# Altium project PCB_Project.PrjPcb
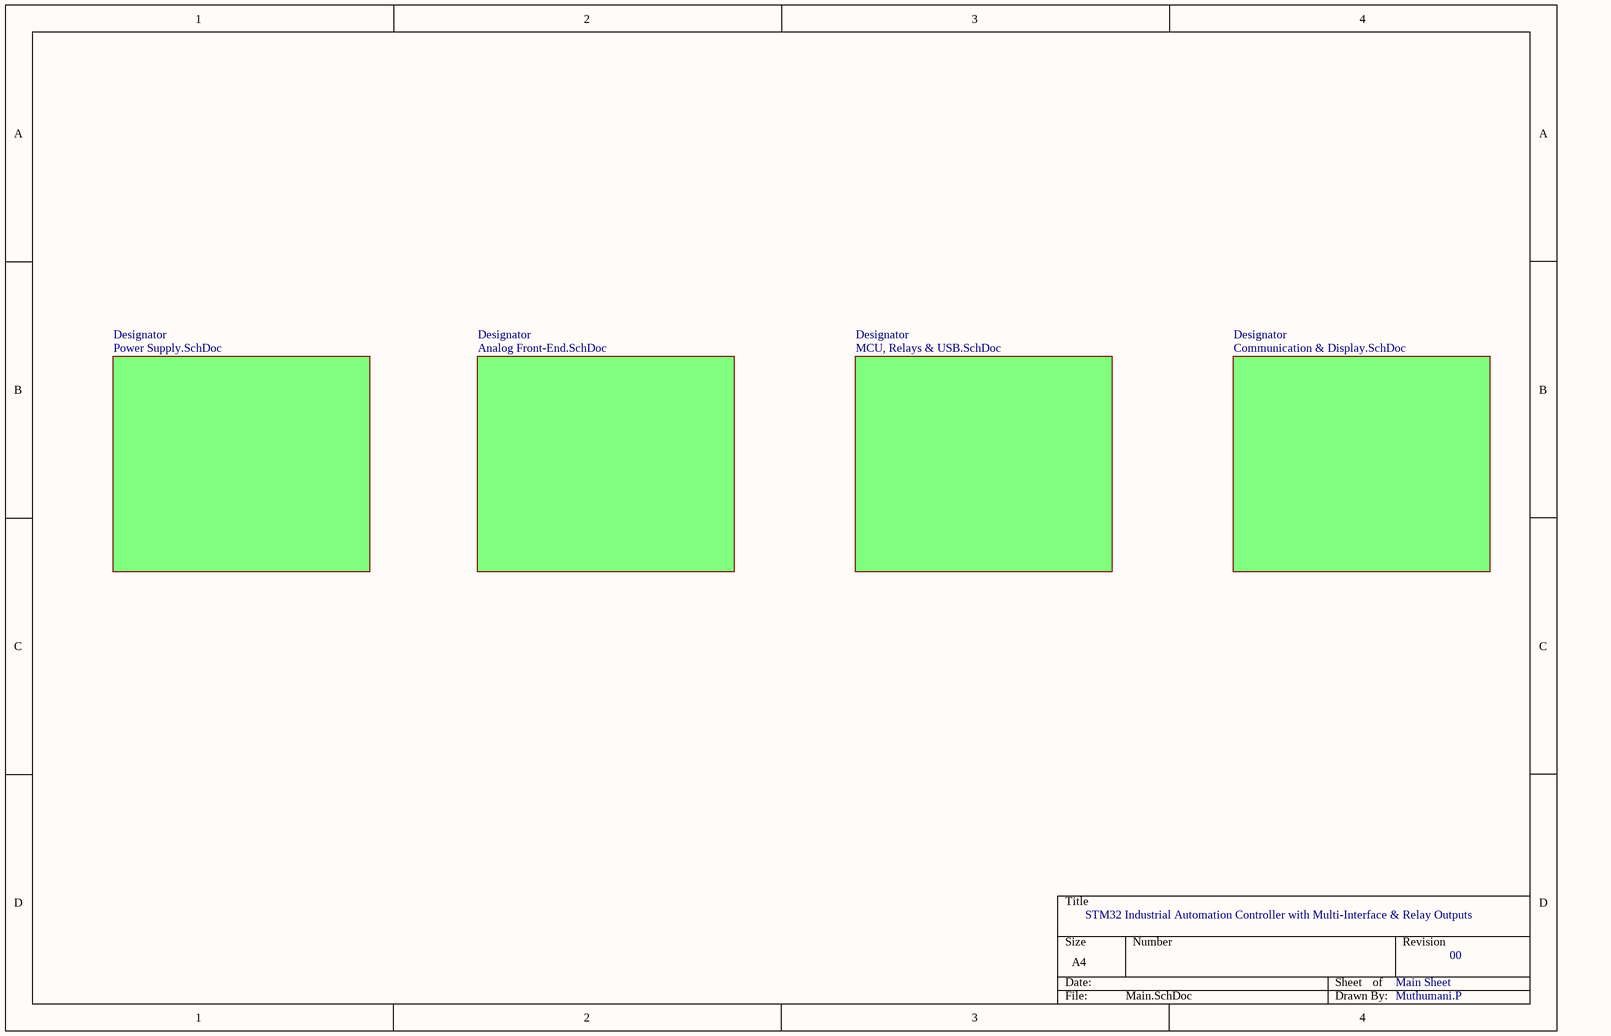
[diagram p0: Main.SchDoc]
5 sheets, 82 parts. Net scope: flat (ports and power ports of the same name join across sheets).
Board file: PCB1.PcbDoc
Sheets:
  Main.SchDoc
    Designator = Power Supply.SchDoc
    Designator = Analog Front-End.SchDoc
    Designator = MCU, Relays & USB.SchDoc
    Designator = Communication & Display.SchDoc

## Sheet Main.SchDoc
size A4; SheetNumber: 1; SheetTotal: 4

### Sub-sheets
Designator = Power Supply.SchDoc: no entries
Designator = Analog Front-End.SchDoc: no entries
Designator = MCU, Relays & USB.SchDoc: no entries
Designator = Communication & Display.SchDoc: no entries

### Notes on the sheet
- STM32 Industrial Automation Controller with Multi-Interface & Relay Outputs
- Main Sheet
- 00
- Muthumani.P

## Sheet Power Supply.SchDoc
size A4; SheetNumber: 2; SheetTotal: 4
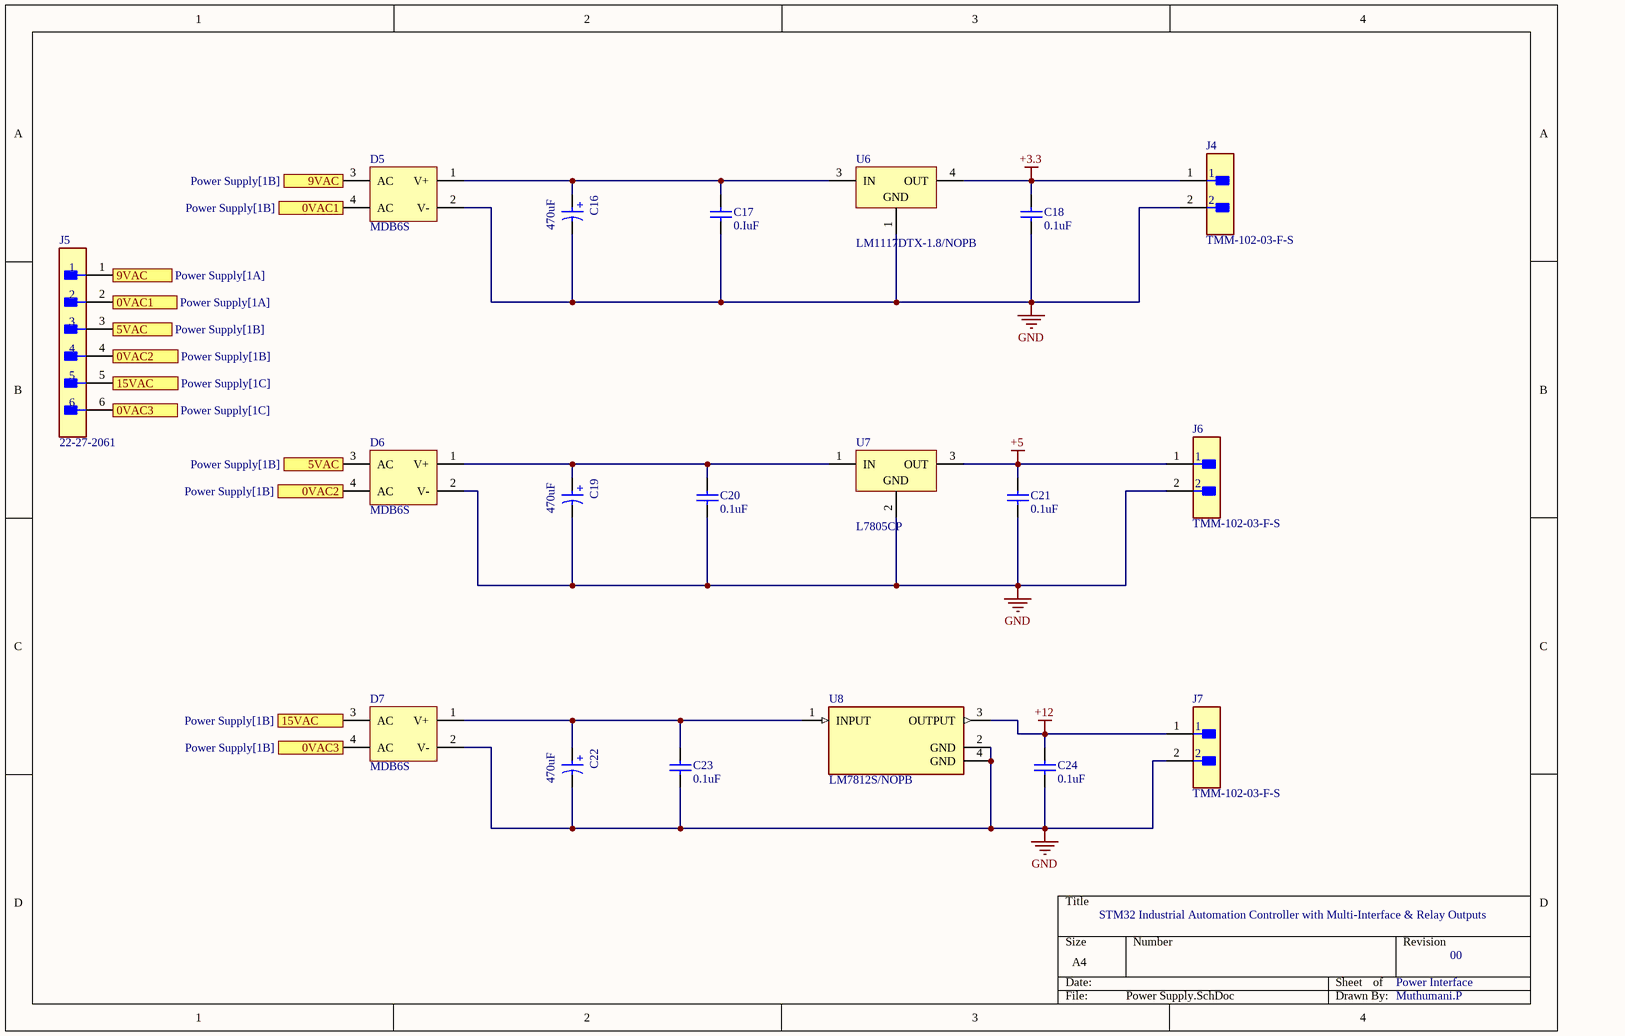
[diagram p1: Power Supply.SchDoc]

### Parts
C16  470uF  [WCAP-ATLI_D13H25]
C17  0.IuF  [CAPC2013X145X50NL20T25]
C18  0.1uF  [CAPC2013X145X50NL20T25]
C19  470uF  [WCAP-ATLI_D13H25]
C20  0.1uF  [CAPC2013X145X50NL20T25]
C21  0.1uF  [CAPC2013X145X50NL20T25]
C22  470uF  [WCAP-ATLI_D13H25]
C23  0.1uF  [CAPC2013X145X50NL20T25]
C24  0.1uF  [CAPC2013X145X50NL20T25]
D5  MDB6S  [FAIR-MDBXS-4_V]
D6  MDB6S  [FAIR-MDBXS-4_V]
D7  MDB6S  [FAIR-MDBXS-4_V]
J4  TMM-102-03-F-S  [FP-TMM-102-03-F-S-MFG]
J5  22-27-2061  [FP-22-27-2061-MFG]
J6  TMM-102-03-F-S  [FP-TMM-102-03-F-S-MFG]
J7  TMM-102-03-F-S  [FP-TMM-102-03-F-S-MFG]
U6  LM1117DTX-1.8/NOPB  [NDP0003B_N]
U7  L7805CP  [TO220FP]
U8  LM7812S/NOPB  [FP-KTT0003B-MFG]

### Ports
0VAC1 (in, see Power Supply[1B]), 0VAC1 (out, see Power Supply[1A]), 0VAC2 (in, see Power Supply[1B]), 0VAC2 (out, see Power Supply[1B]), 0VAC3 (in, see Power Supply[1B]), 0VAC3 (out, see Power Supply[1C]), 5VAC (in, see Power Supply[1B]), 5VAC (out, see Power Supply[1B]), 9VAC (in, see Power Supply[1B]), 9VAC (out, see Power Supply[1A]), 15VAC (in, see Power Supply[1B]), 15VAC (out, see Power Supply[1C])

### Nets
+3.3: C18.2 J4.1 U6.4(OUT)
+5: C21.2 J6.1 U7.3(OUT)
+12: C24.2 J7.1 U8.3(OUTPUT)
GND: C16.2(N) C17.1 C18.1 C19.2(N) C20.1 C21.1 C22.2(N) C23.1 C24.1 D5.2(V-) D6.2(V-) D7.2(V-) J4.2 J6.2 J7.2 U6.1(GND) U7.2(GND) U8.2(GND) U8.4(GND)
NetC16_1: C16.1(P) C17.2 D5.1(V+) U6.3(IN)
NetC19_1: C19.1(P) C20.2 D6.1(V+) U7.1(IN)
NetC22_1: C22.1(P) C23.2 D7.1(V+) U8.1(INPUT)
NetD5_3: D5.3(AC) J5.1 ; port 9VAC
NetD5_4: D5.4(AC) J5.2 ; port 0VAC1
NetD6_3: D6.3(AC) J5.3 ; port 5VAC
NetD6_4: D6.4(AC) J5.4 ; port 0VAC2
NetD7_3: D7.3(AC) J5.5 ; port 15VAC
NetD7_4: D7.4(AC) J5.6 ; port 0VAC3

### Notes on the sheet
- STM32 Industrial Automation Controller with Multi-Interface & Relay Outputs
- Power Interface
- 00
- Muthumani.P
- (in symbol CMP-03913-54218056-2) +

### Library data of the parts
C16 C19 C22 = CMP-03913-54218056-2: Cap, 2700Uf, 16V, Alu Elec, Radial Rohs Compliant: Yes; Life (Hours): 5000hours; Pitch: 5mm; Capacitance: 2.7mF; Leakage Current: 432µA; Tolerance: 20%; Polarity: Polar; Impedance: 22mΩ; Ripple Current: 3A; Mount: Through Hole; Voltage Rating: 16V; Max Operating Temperature: 105°C; Min Operating Temperature: -55°C; Case/Package: Radial; Length: 25mm; Diameter: 13mm; Height - Seated (Max): 26.4922mm; Packaging: Tape & Box (TB); Lead Pitch: 5.0038mm; RoHS: Compliant
C17 C18 C20 C21 C23 C24 = CMP-2007-01227-1: Manufacturer: Kemet; Part Number: C0805S104K5RACTU
D5-D7 = CMP-0950-00003-1: 600 V, 1 A, Single-Phase Bridge Rectifier, -55 to 150 degC, 4-Pin 5 x 4.4 x 1.6 mm MicroDIP, RoHS, Tape and Reel; Manufacturer: Fairchild Semiconductor; IR: 10 uA; VF: 1.1 V; IF (AV): 1 A; VRRM: 600 V; CJ: 10 pF; IFSM: 30 A; ComponentLink1URL: http://www.fairchildsemi.com/; PackageDescription: 4-Pin Micro Surface Mount, Body 5 x 4.4 mm, Height 1.6 mm; ComponentLink1Description: Manufacturer URL; DatasheetVersion: Rev. 1.2.1; PackageReference: MDBXS-4; ComponentLink2Description: Datasheet; ComponentLink2URL: http://www.fairchildsemi.com/ds/MD/MDB10S.pdf; Temp. Range: -55 to 150 degC; Mounting Technology: Surface Mount; PartNumber: MDB6S; Packing: Tape and Reel; RoHS: TRUE
J4 J6 J7 = CMP-02766-001614-1: CONN HEADER VERT 2POS 2MM; Number of Contacts: 2; Gender: Male; Pitch: 2mm; Packaging: Bulk; RoHS Compliant: Yes; Termination: Solder; Contact Plating: Gold; Mount: Through Hole; Number of Rows: 1; Radiation Hardening: No; Lead Free: Lead Free
J5 = CMP-04776-000309-1: CONN HEADER VERT 6POS 2.54MM; Number of Contacts: 6; Current Rating: 4A; Voltage Rating (AC): 250V; Contact Resistance: 10mR; Hole Diameter: 1.02mm; Connector Type: Male Pin; Gender: Male; Mount: Through Hole; REACH SVHC: No SVHC; Number of Rows: 1; Contact Plating: Tin; Series: KK; Depth: 5.8mm; Flammability Rating: UL94 V-0; Contact Type: Male Pin; Lead Pitch: 2.54mm; Min Operating Temperature: 0°C; Pitch: 2.54mm; Radiation Hardening: No; Color: Natural; Length: 15.24mm; Termination: Solder; Orientation: Straight; Contact Material: Brass; Max Voltage Rating (AC): 250V; Housing Material: Nylon; Max Operating Temperature: 75°C; Working Voltage: 250V; Max Current Rating: 4A; Fastening Type: Friction; Voltage Rating: 250V; Housing Color: White; Packaging: Bulk; Material: Nylon; Contact Mating Length: 0.295inch; Package Quantity: 10000; Number of Positions: 6
U6 = CMP-0062-00684-3: 800mA Low-Dropout Linear Regulator, 3-pin TO-252, Pb-Free; Manufacturer: Texas Instruments; PowerWise: N; CompType: LDO IC; PackageTopMarking: NSUZXYTT*LM1117*DT-1.8; ComponentLink1URL: http://www.ti.com/general/docs/lit/getliterature.tsp?genericPartNumber=LM1117-N&fileType=pdf; PackageDescription: TO252, Molded, Jedec, 6.8 x 6.10 x 2.30mm Body, 3 Lead, 2.28mm Pitch, Surface Mount; PinCount: 3; PackageReference: NDP0003B; ComponentLink1Description: Datasheet URL; Code_JEDEC: TO-252-AA; RoHS: Y
U7 = CMP-0244-00474-1: Positive Voltage Regulator, 5V, 3-Pin TO-220FP; ComponentLink1Description: Manufacturer URL; ComponentLink2Description: Datasheet; DatasheetVersion: 16/11/2011; PackageDescription: TO, Thru-Hole, Vertical, Heatsink Mounted; 3 In-Line Leads; Pitch 2.54 mm; ComponentLink2URL: http://www.st.com/internet/com/TECHNICAL_RESOURCES/TECHNICAL_LITERATURE/DATASHEET/CD00000444.pdf; ComponentLink1URL: http://www.st.com; PackageVersion: 2011; PackageReference: TO220FP
U8 = CMP-04917-000197-1: IC REG LINEAR 12V 1.5A; Quiescent Current: 8mA; Dropout Voltage: 2V; Lead Free: Contains Lead; RoHS Compliant: Yes; Min Operating Temperature: 0°C; Case/Package: TO-263; Max Operating Temperature: 125°C

## Sheet Analog Front-End.SchDoc
size A4; SheetNumber: 3; SheetTotal: 5
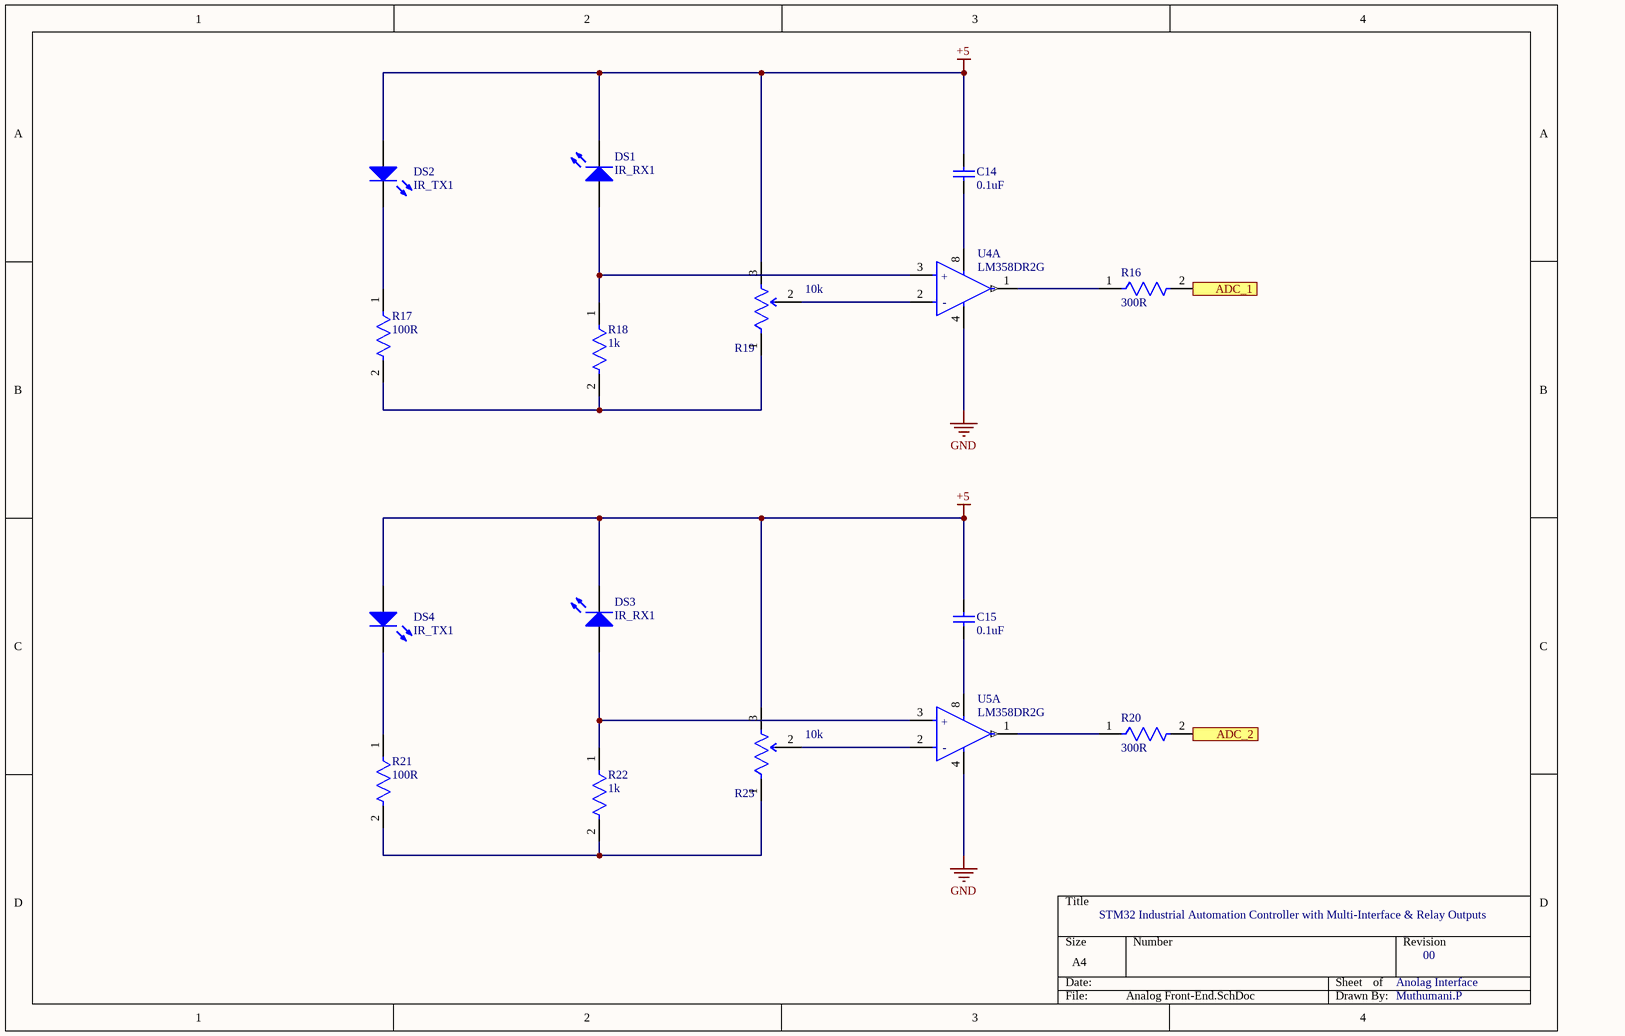
[diagram p2: Analog Front-End.SchDoc]

### Parts
C14  0.1uF  [CAPC2013X145X50NL20T25]
C15  0.1uF  [CAPC2013X145X50NL20T25]
DS1  IR_RX1  [VISH-TSAL6200]
DS2  IR_TX1  [VISH-TSAL6200]
DS3  IR_RX1  [VISH-TSAL6200]
DS4  IR_TX1  [VISH-TSAL6200]
R16  300R  [FP-AC1206-MFG]
R17  100R  [FP-AC1206-MFG]
R18  1k  [FP-AC1206-MFG]
R19  10k  [FP-3296W-MFG]
R20  300R  [FP-AC1206-MFG]
R21  100R  [FP-AC1206-MFG]
R22  1k  [FP-AC1206-MFG]
R23  10k  [FP-3296W-MFG]
U4  LM358DR2G  [FP-751-07-IPC_C]  (part A of 2)
U5  LM358DR2G  [FP-751-07-IPC_C]  (part A of 2)

### Ports
ADC_1 (out, see MCU, Relays & USB[3B]), ADC_2 (out, see MCU, Relays & USB[3C])

### Nets
+5: C14.1 C15.1 DS1.2(K) DS2.1(A) DS3.2(K) DS4.1(A) R19.3(CW) R23.3(CW)
GND: U4.4(VEE/GND) U5.4(VEE/GND)
NetC14_2: C14.2 U4.8(VCC)
NetC15_2: C15.2 U5.8(VCC)
NetDS1_1: DS1.1(A) R18.1 U4.3(INPUT_A+)
NetDS2_2: DS2.2(K) R17.1
NetDS3_1: DS3.1(A) R22.1 U5.3(INPUT_A+)
NetDS4_2: DS4.2(K) R21.1
NetR16_1: R16.1 U4.1(OUTPUT_A)
NetR16_2: R16.2 ; port ADC_1
NetR17_2: R17.2 R18.2 R19.1(CCW)
NetR19_2: R19.2(WIPER) U4.2(INPUT_A-)
NetR20_1: R20.1 U5.1(OUTPUT_A)
NetR20_2: R20.2 ; port ADC_2
NetR21_2: R21.2 R22.2 R23.1(CCW)
NetR23_2: R23.2(WIPER) U5.2(INPUT_A-)

### Notes on the sheet
- STM32 Industrial Automation Controller with Multi-Interface & Relay Outputs
- Anolag Interface
- 00
- Muthumani.P
- (in symbol CMP-1310-00291-2, part A) +; -

### Library data of the parts
C14 C15 = CMP-2007-01227-1: as C17 on sheet Power Supply
DS1-DS4 = CMP-2000-07327-1: High Power Infrared Emitting Diode, GaAlAs, MQW, 1.35 V, 100 mA, -40 to 85 degC, 2-Pin THD, RoHS, Bulk; Manufacturer: Vishay; Lum Intensity: 500mW/srmcd; Product Depth (mm): 5.8mm; Type: IrLED; Luminous Intensity: 500mW/sr; Forward Voltage: 3V; Shape Type: Circular; Peak Wavelength: 950nm; Rad Hardened: No; Product Height (mm): 8.7mm; Number of  Elements: 1; Forward Current: 100mA; High Brightness: Yes; Reverse Voltage: 5V; DELETED: Compliant; Power Dissipation: 160W; Viewing Angle: 34deg; Lens Type: Colored; Packaging: Bulk; Lens Dimensions: 5x5x7.7mm; Package Reference: TSAL6200; Chip Material: GaAlAs; Package Description: 2-Pin Through Hole Device, Dia 5.8 mm, Pitch 2.54 mm; Main Category: IrLED; Manufacturer URL: http://www.vishay.com/; Product Length (mm): 5.8mm; Datasheet URL: http://www.vishay.com/docs/81010/tsal6200.pdf; Operating Temperature Classification: Industrial; Package Type: T-13/4; Pin Count: 2; Mounting: ThroughHole; Mounting Technology: ThroughHole; Test Current (It): 100mA; Datasheet Version: Rev. 2.4, 03/2014; Operating Temp Range: -40Cto85C
R16-R18 R20-R22 = CMP-03412-006130-1: RES SMD 6.2K OHM 5% 1/4W 1206; Manufacturer: Yageo; Manufacturer Part Number: AC1206JR-076K2L; Resistance: 6.2KΩ; Tolerance: 0.05; Voltage Rating: 200V; Automotive Grade: Grade 0; Value: 6.2KΩ; Power Rating: 0.25W; Temperature: -55°C to +155°C; Octopart: https://octopart.com/ac1206jr-076k2l-yageo-30511322; Footprint Url: http://www.yageo.com/exep/pages/download/literatures/PYu-R_Mount_10.pdf; Composition: Thick Film; Device Class L2: Resistors; Temperature Range High: +155°C; Series: AC; Mouser Description: Thick Film Resistors - SMD 1/4W 6.2K ohm 5% AEC-Q200; Device Class L1: Passive Components; Temperature Range Low: -55°C; Height: 0.65mm; Ipc Land Pattern Name: RESC310160X55; Device Class L3: Chip SMD Resistors; ComponentLink2Description: Datasheet; Category: Res; RoHS: TRUE; Automotive: Yes; ComponentLink2URL: http://www.yageo.com/NewPortal/yageodocoutput?fileName=/pdf/R-Chip/PYu-AC_51_RoHS_L_6.pdf; Lead Free: Yes; Package: AC1206; Digikey Description: RES SMD 6.2K OHM 5% 1/4W 1206
R19 R23 = CMP-1747-00001-8: TRIMMER 10K OHM 0.5W PC PIN TOP; Number of Turns: 25; Tolerance: 10%; Resistance: 10kR; Max Power Dissipation: 500mW; Temperature Coefficient: 100ppm/°C; Insulation Resistance: 1GR; Min Operating Temperature: -55°C; Resistor Type: Cermet; Series: 3296; Color: Blue; Mount: Through Hole; Taper: Linear; Radiation Hardening: No; RoHS Compliant: Yes; Width: 9.53mm; Resistance Tolerance: 10%; Contact Plating: Tin; Military Standard: Not; Package Quantity: 50; Weight: 0.03oz; Lead Free: Lead Free; Power Rating: 500mW; Termination: Pin; Technology: CERMET; Max Operating Temperature: 125°C; Packaging: Rail/Tube; Length: 9.53mm; Depth: 4.83mm; Height: 11.55mm; Reach SVHC Compliant: Yes
U4 U5 = CMP-1310-00291-2: IC OPAMP GP 2 CIRCUIT 8SOIC; Gain Bandwidth Product: 1MHz; Number of Circuits: 2; Min Supply Voltage: 3V; Slew Rate: 0.6V/µs; Max Dual Supply Voltage: 16V; Common Mode Rejection Ratio: 65dB; Input Bias Current: 250nA; Min Dual Supply Voltage: 1.5V; Dual Supply Voltage: 9V; Operating Supply Current: 1.5mA; Output Current: 40mA; Input Offset Voltage (Vos): 7mV; Nominal Supply Current: 1.2mA; Voltage Gain: 100dB; Max Supply Voltage: 32V; Width: 4mm; Number of Pins: 8; Min Operating Temperature: 0°C; REACH SVHC: No SVHC; Contact Plating: Tin; Lead Free: Lead Free; Halogen Free: Halogen Free; Power Supply Rejection Ratio (PSRR): 65dB; Operating Supply Voltage: 16V; Package Quantity: 2500; Max Operating Temperature: 70°C; Case/Package: SOIC; Height: 1.5mm; Packaging: Tape and Reel; Radiation Hardening: No; Number of Channels: 2; Bandwidth: 1MHz; Length: 5mm; Number of Elements: 2; Number of Amplifiers: 2; Output Current per Channel: 40mA

## Sheet MCU, Relays & USB.SchDoc
size A4; SheetNumber: 4; SheetTotal: 4
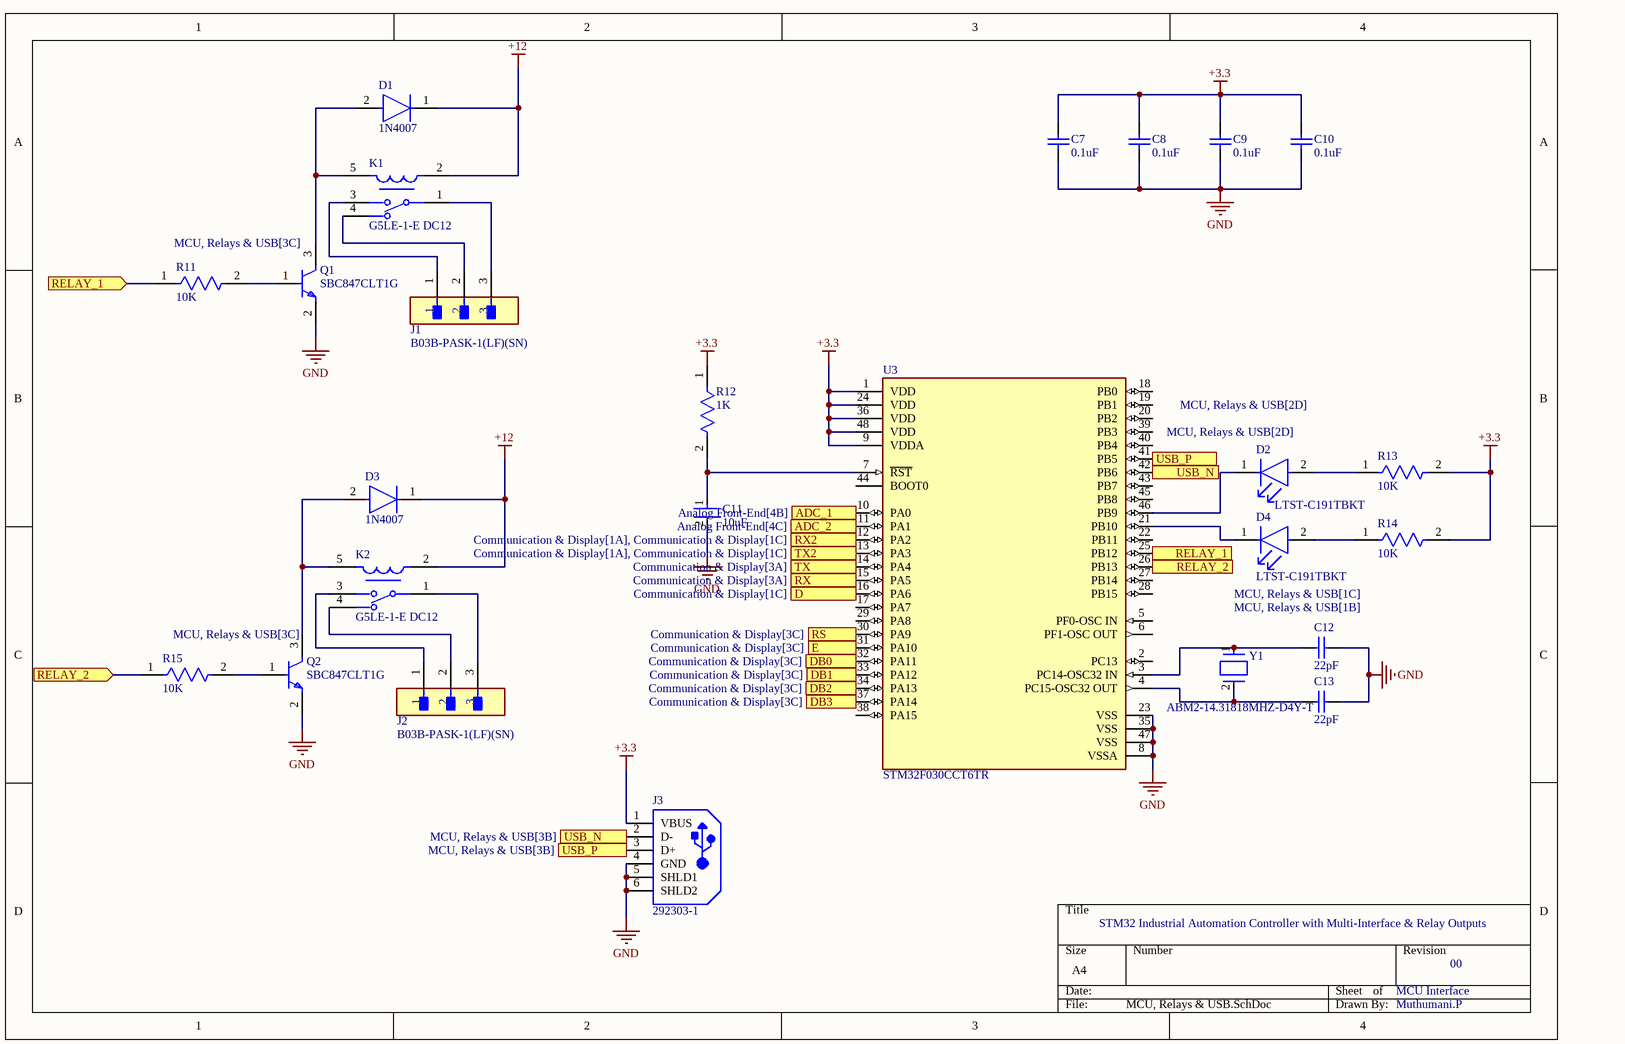
[diagram p3: MCU, Relays & USB.SchDoc]

### Parts
C7  0.1uF  [CAPC1608X90X35ML10T15]
C8  0.1uF  [CAPC1608X90X35ML10T15]
C9  0.1uF  [CAPC1608X90X35ML10T15]
C10  0.1uF  [CAPC1608X90X35ML10T15]
C11  10uF  [FP-GRM18-0_15-MFG]
C12  22pF  [CAPC1608X90X35ML10T15]
C13  22pF  [CAPC1608X90X35ML10T15]
D1  1N4007  [FP-1N4007-MFG]
D2  LTST-C191TBKT  [FP-LTST-C191TBKT-MFG]
D3  1N4007  [FP-1N4007-MFG]
D4  LTST-C191TBKT  [FP-LTST-C191TBKT-MFG]
J1  B03B-PASK-1(LF)(SN)  [FP-B03B-PASK-1_LF_SN-MFG]
J2  B03B-PASK-1(LF)(SN)  [FP-B03B-PASK-1_LF_SN-MFG]
J3  292303-1  [TE-292303-1_V]
K1  G5LE-1-E DC12  [FP-G5LE-1-E_DC12-MFG]
K2  G5LE-1-E DC12  [FP-G5LE-1-E_DC12-MFG]
Q1  SBC847CLT1G  [FP-318-08-MFG]
Q2  SBC847CLT1G  [FP-318-08-MFG]
R11  10K  [FP-RC0603-0_55-IPC_C]
R12  1K  [FP-RC0603-0_55-IPC_C]
R13  10K  [FP-RC0603-0_55-IPC_C]
R14  10K  [FP-RC0603-0_55-IPC_C]
R15  10K  [FP-RC0603-0_55-IPC_C]
U3  STM32F030CCT6TR  [FP-LQFP48-5B-IPC_A]
Y1  ABM2-14.31818MHZ-D4Y-T  [FP-ABM2-MFG]

### Ports
ADC_1 (in, see Analog Front-End[4B]), ADC_2 (in, see Analog Front-End[4C]), D (in, see Communication & Display[1C]), DB0 (see Communication & Display[3C]), DB1 (see Communication & Display[3C]), DB2 (see Communication & Display[3C]), DB3 (see Communication & Display[3C]), E (see Communication & Display[3C]), RELAY_1 (in, see MCU, Relays & USB[3C]), RELAY_1 (out, see MCU, Relays & USB[1B]), RELAY_2 (in, see MCU, Relays & USB[3C]), RELAY_2 (out, see MCU, Relays & USB[1C]), RS (see Communication & Display[3C]), RX2 (in, see Communication & Display[1A], Communication & Display[1C]), RX (in, see Communication & Display[3A]), TX2 (in, see Communication & Display[1A], Communication & Display[1C]), TX (in, see Communication & Display[3A]), USB_N (out, see MCU, Relays & USB[2D]), USB_N (out, see MCU, Relays & USB[3B]), USB_P (out, see MCU, Relays & USB[2D]), USB_P (out, see MCU, Relays & USB[3B])

### Nets
+3.3: C7.1 C8.1 C9.1 C10.1 J3.1(VBUS) R12.1 R13.2 R14.2 U3.1(VDD) U3.9(VDDA) U3.24(VDD) U3.36(VDD) U3.48(VDD)
+12: D1.1(C) D3.1(C) K1.2 K2.2
GND: C7.2 C8.2 C9.2 C10.2 C11.2 C12.2 C13.2 J3.4(GND) J3.5(SHLD1) J3.6(SHLD2) Q1.2(E) Q2.2(E) U3.8(VSSA) U3.23(VSS) U3.35(VSS) U3.47(VSS)
NetC11_1: C11.1 R12.2 U3.7(~{RST})
NetC12_1: C12.1 U3.3(PC14-OSC32_IN) Y1.1
NetC13_1: C13.1 U3.4(PC15-OSC32_OUT) Y1.2
NetD1_2: D1.2(A) K1.5 Q1.3(C)
NetD2_1: D2.1(C) U3.46(PB9)
NetD2_2: D2.2(A) R13.1
NetD3_2: D3.2(A) K2.5 Q2.3(C)
NetD4_1: D4.1(C) U3.21(PB10)
NetD4_2: D4.2(A) R14.1
NetJ1_1: J1.1 K1.3
NetJ1_2: J1.2 K1.4
NetJ1_3: J1.3 K1.1
NetJ2_1: J2.1 K2.3
NetJ2_2: J2.2 K2.4
NetJ2_3: J2.3 K2.1
NetJ3_2: J3.2(D-) U3.42(PB6) ; port USB_N
NetJ3_3: J3.3(D+) U3.41(PB5) ; port USB_P
NetP2_4: U3.30(PA9) ; port RS
NetP2_6: U3.31(PA10) ; port E
NetP2_7: U3.32(PA11) ; port DB0
NetP2_8: U3.33(PA12) ; port DB1
NetP2_9: U3.34(PA13) ; port DB2
NetP2_10: U3.37(PA14) ; port DB3
NetQ1_1: Q1.1(B) R11.2
NetQ2_1: Q2.1(B) R15.2
NetR3_1: U3.12(PA2) ; port RX2
NetR4_2: U3.14(PA4) ; port TX
NetR5_1: U3.13(PA3) ; port TX2
NetR6_2: U3.15(PA5) ; port RX
NetR11_1: R11.1 U3.25(PB12) ; port RELAY_1
NetR15_1: R15.1 U3.26(PB13) ; port RELAY_2
NetR16_2: U3.10(PA0) ; port ADC_1
NetR20_2: U3.11(PA1) ; port ADC_2
NetU2_2: U3.16(PA6) ; port D

Not connected (* = marked no-connect by the designer): U3 2(PC13) 5(PF0-OSC_IN) 6(PF1-OSC_OUT) 17(PA7) 18(PB0) 19(PB1) 20(PB2) 22(PB11) 27(PB14) 28(PB15) 29(PA8) 38(PA15) 39(PB3) 40(PB4) 43(PB7) 44(BOOT0) 45(PB8)

### Notes on the sheet
- STM32 Industrial Automation Controller with Multi-Interface & Relay Outputs
- MCU Interface
- 00
- Muthumani.P

### Library data of the parts
C7-C10 = CMP-2100-03643-1: Chip Capacitor, 0.1 uF, +/- 10%, 50 V, -55 to 125 degC, 0603 (1608 Metric), RoHS, Tape and Reel; Manufacturer: Murata; Dielectric Material: Ceramic; Voltage Rating: 50V; Capacitance: 100nF; Dielectric: X7R; Insulation Resistance: 10GR; Case Code (Metric): 1608; Lead Free: LeadFree; Depth: 0.8mm; Number of Pins: 2; Radiation Hardening: No; Case/Package: 0603; Manufacturer URL: http://www.murata.com/; Packaging: TapeandReel; Length: 1.6mm; Contact Plating: Tin; Datasheet URL: http://psearch.en.murata.com/capacitor/product/GRM188R71H104KA93%23.pdf; Tolerance: 10%; Case Code (Imperial): 0603; Min Operating Temperature: -55degC; RoHSCompliant: true; Voltage: 50V; Termination: SMD/SMT; Mount: SurfaceMount; Material: Ceramic; Package Quantity: 1; Height: 0.8mm; Thickness: 0.035inch; REACH SVHC: NoSVHC; Max Operating Temperature: 125degC; Width: 0.8mm; Package Reference: 0603; Voltage Rating (DC): 50V; Datasheet Version: 42675.0; Package Description: 2-Pin Surface Mount Device, Body 1.6 x 0.8 mm
C11 = CMP-2000-05448-2: CAP CER 10UF 10V X5R 0603; Manufacturer Part Number: GRM188R61A106KE69D; Manufacturer: Murata; Temperature Coefficient: 15%; Material: Ceramic; Tolerance: 10%; Device Class L1: Passive Components; ComponentLink2Description: Datasheet; Height: 0.95mm; Package: GRM18-0.15; Octopart: https://octopart.com/grm188r61a106ke69d-murata-22851381; Value: 10uF; Digikey Description: CAP CER 10UF 10V X5R 0603; Temperature Range High: +85°C; Temperature Range Low: -55°C; Temperature Characteristic: X5R; Capacitance: 10uF; RoHS: TRUE; Device Class L2: Capacitors; ComponentLink2URL: https://search.murata.co.jp/Ceramy/image/img/A01X/G101/ENG/GRM188R61A106KE69-01A.pdf; Device Class L3: Ceramic Capacitors; Lead Free: Yes; Mouser Description: Multilayer Ceramic Capacitors MLCC - SMD/SMT 0603 10uF 10volts X5R + - 10%; Category: Cap; Voltage Rating: 10V; Temperature: -55°C to +85°C; Automotive: No
C12 C13 = CMP-2000-04945-1: Chip Capacitor, 22 pF, +/- 5%, 50 V, -55 to 125 degC, 0603 (1608 Metric), RoHS, Tape and Reel; Manufacturer: Murata; Rated Voltage: 50V; Dielectric: C0G; Capacitance: 22pF; Manufacturer URL: http://www.murata.com/; Datasheet Version: Jul-06; Package Reference: 603; Tolerance (%): ±5%; Case Size/Dimension: 0603; Package Description: 2-Pin Surface Mount Device, Body 1.6 x 0.8 mm; Datasheet URL: https://datasheet.ciiva.com/11786/0900766b807a1cab-11786398.pdf
D1 D3 = CMP-123542-000001-1: Rectifier diode 1000 V 1 A DO-41, ,; Manufacturer: Diotec; Max Surge Forward Current: 27A; Forward Current: 1A; Max Junction Temp: +175°C; Reverse Voltage: 1000V; Value: 15pF; Peak Reverse Current: 5uA; Category: Diode; Temperature Range Low: -50°C; Automotive: No; Temperature: -50°C to +175°C; Lead Free: Yes; ComponentLink2Description: Datasheet; Max Repetitive Reverse Voltage: 1000V; ComponentLink2URL: https://datasheet.octopart.com/1N4007-Diotec-datasheet-62346875.pdf; Manufacturer Part Number: 1N4007; Device Class L3: Rectifier Diodes; Height: 2.8mm; Octopart: https://octopart.com/1n4007-diotec-4040411; Package: 1N4007; Temperature Range High: +175°C; Device Class L1: Discrete Semiconductors; Device Class L2: Diodes; RoHS: TRUE; Capacitance: 15pF; Ipc Land Pattern Name: DIOAD888W100L520D280
D2 D4 = CMP-22017-000008-1: LED BLUE CLEAR CHIP SMD; Lens Color: Colorless; Dominant Wavelength: 475nm; Forward Current: 20mA; Wavelength: 468nm; Viewing Angle: 130°; Power Dissipation: 76mW; Luminous Intensity: 180mcd; Reverse Voltage: 5V; Number of Elements: 1; Lens Style: Diffused; Forward Voltage: 3.8V; Max Power Dissipation: 75mW; Case Code (Metric): 1608; Packaging: Tape and Reel; Case/Package: 0603; Depth: 1.6mm; Mount: Surface Mount; Lead Free: Lead Free; Min Operating Temperature: -20°C; Lens Transparency: Clear; Illumination Color: Blue; Height: 0.55mm; Test Current: 20mA; Case Code (Imperial): 0603; Max Operating Temperature: 80°C; Number of Pins: 2; Length: 0.8mm; Radiation Hardening: No; Package Quantity: 1; Number of LEDs: 1; Width: 0.8mm; Color: Blue
J1 J2 = CMP-17439-000193-1: CONN HEADER VERT 3POS 2MM; Voltage Rating: 250V; Current Rating: 3A; Mated Stacking Heights: 14.9mm; Number of Positions: 3; Packaging: Bulk; Contact Type: Male Pin; Flammability Rating: UL94 V-0; Contact Shape: Square; Number of Rows: 1; Color: Natural; Orientation: Straight; Housing Color: White; Fastening Type: Ramp; Insulation Material: PBT; Insulation Color: Natural; Mount: Through Hole; Contact Finish - Mating: TIN; Connector Type: Header; Termination: Solder; Contact Mating Length: 0.126inch; Lead Free: Lead Free; Contact Material: Copper Alloy; Pitch: 2mm; Series: PA; Number of Contacts: 3; Contact Plating: Tin
J3 = CMP-2000-05404-1: 1 Port Right Angle Through Hole Mount Female Type A USB Connector, 4 Position, -55 to 85 degC, RoHS, Tube; Manufacturer: TE Connectivity; Contact Termination Type: Solder; No. of Contacts: 4; Connector Mounting: PCB; SVHC: NoSVHC(16-Jun-2014); Gender: Receptacle; Connector Type: USBA; Package Description: 4-Pin Through Hole Device, Body 14 x 13.13 mm, Pitch 2.5 mm; Contact Plating: Gold; Package Reference: 292303-1; Contact Material: Copper; Datasheet URL: http://www.farnell.com/cad/1653030.pdf; Datasheet Version: Feb-12; Manufacturer URL: http://www.te.com/
K1 K2 = CMP-08822-000240-1: RELAY GEN PURPOSE SPDT 16A 12V; Voltage Rating (AC): 250V; Coil Type: Non-Latching; Release Time: 5ms; Relay Type: General Purpose; Power Consumption: 400mW; Coil Current: 33.3mA; Application(s): POWER; Coil Resistance: 360R; Life (Hours): 1000000Hour; Operate Time: 10ms; Contact Material: Tin; Number of Pins: 5; Min Operating Temperature: -40°C; Width: 16.5mm; Weight: 12g; Mount: Through Hole; Contact Current Rating: 16A; Series: G5LE-E; Termination: Solder; Coil Voltage (DC): 12V; Height: 19mm; Max Operating Temperature: 85°C; Depth: 16.5mm; Length: 22.5mm; Packaging: Tray; Max Voltage Rating (AC): 250V; Package Quantity: 100; Coil Power: 400mW; Throw Configuration: SPDT; Lead Free: Lead Free; Max Current Rating: 16A
Q1 Q2 = CMP-1048-00766-2: Manufacturer Lifecycle Status: ACTIVE; NexarPartId: 22133919; Max Frequency: 100MHz; hFE Min: 420; Collector Base Voltage (VCBO): 50V; Power Dissipation: 225mW; Max Junction Temperature (Tj): 150°C; Max Breakdown Voltage: 45V; Collector Emitter Saturation Voltage: 600mV; Max Power Dissipation: 300mW; Polarity: NPN; Max Collector Current: 100mA; Number of Elements: 1; Emitter Base Voltage (VEBO): 6V; Element Configuration: Single; Gain Bandwidth Product: 100MHz; Case/Package: SOT-23-3; Height: 1.01mm; Number of Pins: 3; Max Operating Temperature: 150°C; Min Operating Temperature: -55°C; Schedule B: 8541210080, 8541210080; Transition Frequency: 100MHz; Collector Emitter Breakdown Voltage: 45V; Length: 3.04mm; Continuous Collector Current: 100mA; Packaging: Tape & Reel; Frequency: 100MHz; Width: 1.4mm; Lead Free: Lead Free; Lifecycle Status: Production; RoHS: Compliant; Halogen Free: Halogen Free; Radiation Hardening: No; Collector Emitter Voltage (VCEO): 45V
R11 R13-R15 = CMP-2100-03664-2: RES 10K OHM 1% 1/10W 0603; Voltage Rating: 75V; Voltage Rating (DC): 50V; Resistance: 10kR; Power Rating: 100mW; Temperature Coefficient: 100ppm/°C; Depth: 0.8mm; Termination: SMD/SMT; Resistor Type: Thick Film; Series: RC; Construction: Rectangular; Features: Moisture Resistant; Packaging: Tape and Reel; Min Operating Temperature: -55°C; Number of Terminations: 2; Lead Pitch: 0.3mm; RoHS Compliant: Yes; Case/Package: 0603; Resistance Tolerance: 1%; Military Standard: Not; Weight: 7.1E-05oz; Number of Pins: 2; Tolerance: 1%; Length: 1.6mm; Case Code (Imperial): 0603; Lead Free: Lead Free; Width: 0.8mm; Max Power Dissipation: 100mW; Height: 0.45mm; Max Operating Temperature: 155°C; Case Code (Metric): 1608; Size Code: 0603
R12 = CMP-1659-00009-5: RES 1K OHM 1% 1/10W 0603; Resistance: 1kR; Voltage Rating: 50V; Power Rating: 100mW; Temperature Coefficient: 100ppm/°C; Military Standard: Not; REACH SVHC: No SVHC; Size Code: 0603; Features: Moisture Resistant; Number of Terminations: 2; Technology: THICK FILM; Series: RC; Case Code (Metric): 1608; Resistance Tolerance: 1%; Resistor Type: Thick Film; Termination: SMD/SMT; Contact Plating: Tin; Radiation Hardening: No; Min Operating Temperature: -55°C; Max Operating Temperature: 155°C; Packaging: Tape and Reel; Max Power Dissipation: 100mW; RoHS Compliant: Yes; Height: 0.45mm; Lead Free: Lead Free; Case/Package: 0603; Length: 1.6mm; Tolerance: 1%; Case Code (Imperial): 0603; Construction: Rectangular; Depth: 0.8mm
U3 = CMP-12105-000129-1: IC MCU 32BIT 256KB FLASH 48LQFP; Core Architecture: ARM; Peripherals: POR; Interface: I2C; Frequency: 48MHz; Oscillator Type: Internal; Number of I/Os: 39; Packaging: Cut Tape; Memory Size: 256KB; RoHS Compliant: Yes; Min Operating Temperature: -40°C; Case/Package: LQFP; Max Operating Temperature: 85°C; Number of Pins: 48; Memory Type: FLASH
Y1 = CMP-27762-013666-1: Crystal 14.31818MHz ±30ppm 18pF SMD-2 8mm x 4.5mm; ESR (Equivalent Series Resistance): 60R; Height: 0.063inch; Case/Package: CSMD; Width: 0.177inch; Load Capacitance: 18pF; Frequency Tolerance: 30ppm; Termination: SMD/SMT; Tolerance: 30ppm; Number of Pins: 2; Max Operating Temperature: 85°C; Series: ABM2; Frequency: 14.31818MHz; Mount: Surface Mount; Length: 8mm; Resistor Type: Ceramic; Package Quantity: 1000; Depth: 4.5mm; Min Operating Temperature: -40°C; Radiation Hardening: No; Frequency Stability: 30ppm; Packaging: Tape and Reel

## Sheet Communication & Display.SchDoc
size A4; SheetNumber: 4; SheetTotal: 4
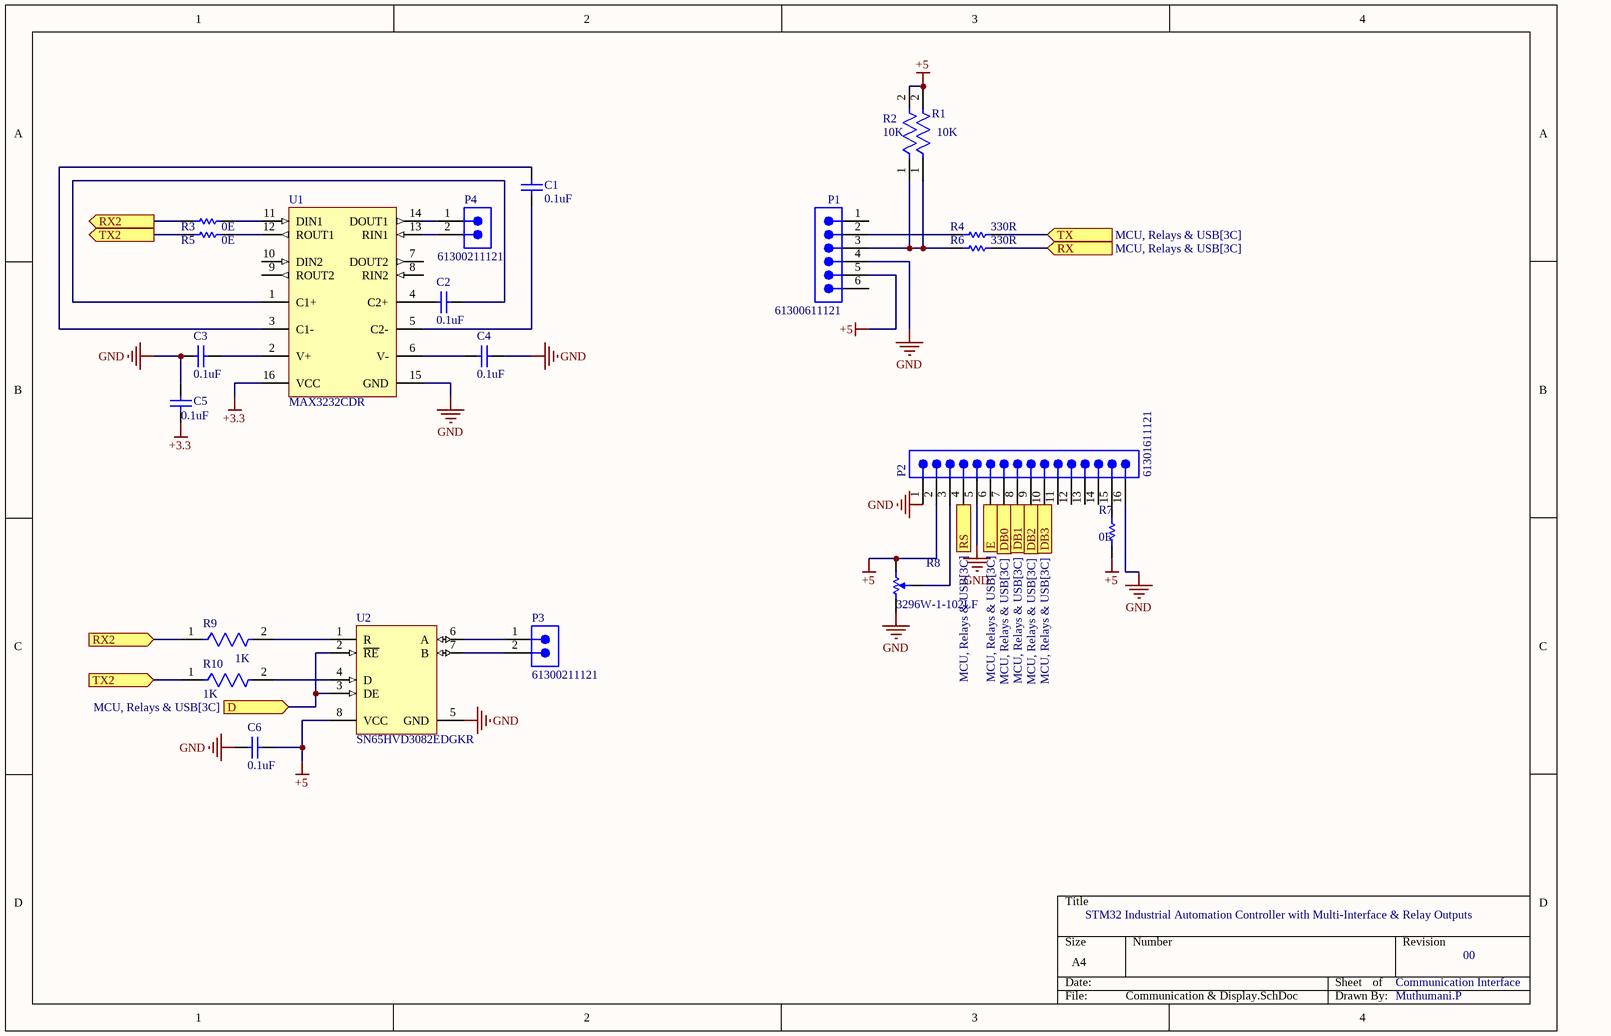
[diagram p4: Communication & Display.SchDoc]

### Parts
C1  0.1uF  [CAPC1608X90X35ML10T15]
C2  0.1uF  [CAPC1608X90X35ML10T15]
C3  0.1uF  [CAPC1608X90X35ML10T15]
C4  0.1uF  [CAPC1608X90X35ML10T15]
C5  0.1uF  [CAPC1608X90X35ML10T15]
C6  0.1uF  [CAPC1608X90X35ML10T15]
P1  61300611121  [61300611121]
P2  61301611121  [61301611121]
P3  61300211121  [61300211121]
P4  61300211121  [61300211121]
R1  10K  [FP-RC0603-0_55-IPC_C]
R2  10K  [FP-RC0603-0_55-IPC_C]
R3  0E  [RESC1608X55X25ML10T15]
R4  330R  [RESC1608X55X25NL10T15]
R5  0E  [RESC1608X55X25ML10T15]
R6  330R  [RESC1608X55X25NL10T15]
R7  0E  [RESC1608X55X25ML10T15]
R8  3296W-1-102LF  [BOUR-3296W-1-3]
R9  1K  [FP-RC0603-0_55-IPC_C]
R10  1K  [FP-RC0603-0_55-IPC_C]
U1  MAX3232CDR  [D0016A_L]
U2  SN65HVD3082EDGKR  [DGK0008A_M]

### Ports
D (in, see MCU, Relays & USB[3C]), DB0 (see MCU, Relays & USB[3C]), DB1 (see MCU, Relays & USB[3C]), DB2 (see MCU, Relays & USB[3C]), DB3 (see MCU, Relays & USB[3C]), E (see MCU, Relays & USB[3C]), RS (see MCU, Relays & USB[3C]), RX2 (in, see Communication & Display[1A], MCU, Relays & USB[3C]), RX2 (out, see Communication & Display[1C], MCU, Relays & USB[3C]), RX (in, see MCU, Relays & USB[3C]), TX2 (in, see Communication & Display[1A], MCU, Relays & USB[3C]), TX2 (out, see Communication & Display[1C], MCU, Relays & USB[3C]), TX (in, see MCU, Relays & USB[3C])

### Nets
+3.3: C5.2 U1.16(VCC)
+5: C6.1 P1.5 P2.2 R1.2 R2.2 R7.1 R8.2(B) U2.8(VCC)
GND: C3.2 C4.2 C5.1 C6.2 P1.4 P2.1 P2.5 P2.16 R8.1(A) U1.15(GND) U2.5(GND)
NetC1_1: C1.1 U1.5(C2-)
NetC1_2: C1.2 U1.3(C1-)
NetC2_1: C2.1 U1.4(C2+)
NetC2_2: C2.2 U1.1(C1+)
NetC3_1: C3.1 U1.2(V+)
NetC4_1: C4.1 U1.6(V-)
NetP1_2: P1.2 R4.1
NetP1_3: P1.3 R1.1 R2.1 R6.1
NetP2_3: P2.3 R8.3(TAP)
NetP2_4: P2.4 ; port RS
NetP2_6: P2.6 ; port E
NetP2_7: P2.7 ; port DB0
NetP2_8: P2.8 ; port DB1
NetP2_9: P2.9 ; port DB2
NetP2_10: P2.10 ; port DB3
NetP2_15: P2.15 R7.2
NetP3_1: P3.1 U2.6(A)
NetP3_2: P3.2 U2.7(B)
NetP4_1: P4.1 U1.14(DOUT1)
NetP4_2: P4.2 U1.13(RIN1)
NetR3_1: R3.1 R9.1 ; port RX2
NetR3_2: R3.2 U1.11(DIN1)
NetR4_2: R4.2 ; port TX
NetR5_1: R5.1 R10.1 ; port TX2
NetR5_2: R5.2 U1.12(ROUT1)
NetR6_2: R6.2 ; port RX
NetR9_2: R9.2 U2.1(R)
NetR10_2: R10.2 U2.4(D)
NetU2_2: U2.2(~{RE}) U2.3(DE) ; port D

Not connected (* = marked no-connect by the designer): P1 1 6; P2 11 12 13 14; U1 7(DOUT2) 8(RIN2) 9(ROUT2) 10(DIN2)

### Notes on the sheet
- STM32 Industrial Automation Controller with Multi-Interface & Relay Outputs
- Communication Interface
- 00
- Muthumani.P

### Library data of the parts
C1-C6 = CMP-2100-03643-1: as C7 on sheet MCU, Relays & USB; Case Code (Metric): 1608; Lead Free: LeadFree; Depth: 0.8mm; Number of Pins: 2; Radiation Hardening: No; Case/Package: 0603; Manufacturer URL: http://www.murata.com/; Packaging: TapeandReel; Length: 1.6mm; Contact Plating: Tin; Datasheet URL: http://psearch.en.murata.com/capacitor/product/GRM188R71H104KA93%23.pdf; Tolerance: 10%; Case Code (Imperial): 0603; Min Operating Temperature: -55degC; RoHSCompliant: true; Voltage: 50V; Termination: SMD/SMT; Mount: SurfaceMount; Material: Ceramic; Package Quantity: 1; Height: 0.8mm; Thickness: 0.035inch; REACH SVHC: NoSVHC; Max Operating Temperature: 125degC; Width: 0.8mm; Package Reference: 0603; Voltage Rating (DC): 50V; Datasheet Version: 42675.0; Package Description: 2-Pin Surface Mount Device, Body 1.6 x 0.8 mm
P1 = CMP-1502-01070-4: THT Vertical Pin Header WR-PHD, Pitch 2.54 mm, Single Row, 6 pins; Pitch: 2.54mm; Operating Supply Voltage: 250V; Connector Type: Male Pin; Gender: Male; Number of Positions: 6; Contact Resistance: 20mΩ; Current Rating: 3A; Termination: Through Hole; Color: Black; Number of Pins: 6; Lead Pitch: 2.54mm; Height: 8.89mm; RoHS: Compliant; Lead Free: Lead Free; Contact Mating Length: 5.9944mm; Contact Plating: Gold; Contact Gender: Male; Packaging: Bulk; Orientation: Vertical; Mount: Through Hole; Voltage Rating: 250V; Number of Rows: 1; Max Operating Temperature: 105°C; Min Operating Temperature: -40°C; Housing Material: PBT; Contact Material: Gold; Number of Contacts: 6
P2 = CMP-1502-01095-5: THT Vertical Pin Header WR-PHD, Pitch 2.54 mm, Single Row, 16 pins; Connector Type: Male Pin; Contact Resistance: 20mΩ; Number of Contacts: 16; Pitch: 2.54mm; Gender: Male; Voltage Rating: 250V; Current Rating: 3A; Contact Material: Gold; Min Operating Temperature: -40°C; Height: 8.89mm; Termination: Solder; Mount: Through Hole; Max Operating Temperature: 105°C; Number of Rows: 1; Color: Black; Contact Mating Length: 5.9944mm; Orientation: Vertical; Operating Supply Voltage: 250V; RoHS: Compliant; Packaging: Bulk; Number of Pins: 16; Lead Pitch: 2.54mm; Contact Plating: Gold; Number of Positions: 16
P3 P4 = CMP-1712-00002-7: THT Vertical Pin Header WR-PHD, Pitch 2.54 mm, Single Row, 2 pins; Pitch: 2.54mm; Number of Contacts: 2; Connector Type: Male Pin; Gender: Male; Contact Resistance: 20mΩ; Operating Supply Voltage: 250V; Current Rating: 3A; Housing Material: PBT; RoHS: Compliant; Lead Free: Lead Free; Contact Material: Gold; REACH SVHC: No; Min Operating Temperature: -40°C; Termination: Through Hole; Number of Pins: 2; Contact Gender: Male; Packaging: Bulk; Lead Pitch: 2.54mm; Contact Plating: Gold; Orientation: Vertical; Mount: Through Hole; Height: 8.94mm; Color: Black; Number of Positions: 2; Contact Mating Length: 5.9944mm; Max Operating Temperature: 105°C; Voltage Rating: 250V; Number of Rows: 1
R1 R2 = CMP-2100-03664-2: as R11 on sheet MCU, Relays & USB; Depth: 0.8mm; Termination: SMD/SMT; Resistor Type: Thick Film; Series: RC; Construction: Rectangular; Features: Moisture Resistant; Packaging: Tape and Reel; Min Operating Temperature: -55°C; Number of Terminations: 2; Lead Pitch: 0.3mm; RoHS Compliant: Yes; Case/Package: 0603; Resistance Tolerance: 1%; Military Standard: Not; Weight: 7.1E-05oz; Number of Pins: 2; Tolerance: 1%; Length: 1.6mm; Case Code (Imperial): 0603; Lead Free: Lead Free; Width: 0.8mm; Max Power Dissipation: 100mW; Height: 0.45mm; Max Operating Temperature: 155°C; Case Code (Metric): 1608; Size Code: 0603
R3 R5 R7 = CMP-2100-03667-1: Chip Resistor, 0 Ohm, +/- 5%, 0.1 W, -55 to 155 degC, 0603 (1608 Metric), RoHS, Tape and Reel; Manufacturer: Yageo; Temperature Coefficient: 200ppm/degreesC; Voltage Rating: 50V; Power Rating: 100mW; Resistance: 0mOhm; Width: 0.8mm; Max Operating Temperature: 155degC; Tolerance: 5%; Package Reference: 0603; Height: 0.45mm; Depth: 0.8mm; Package Description: 2-Pin Surface Mount Device, Body 1.6 x 0.8 mm; Termination: SMD/SMT; Package Quantity: 5000; Case/Package: 0603; Case Code (Imperial): 0603; Radiation Hardening: No; Number of Pins: 2; Length: 1.6mm; Lead Free: LeadFree; Voltage Rating (DC): 50V; Military Standard: Not; Datasheet URL: http://www.yageo.com/NewPortal/yageodocoutput?fileName=/pdf/R-Chip/PYu-RC_Group_51_RoHS_L_5.pdf; Manufacturer URL: http://www.yageo.com/; Packaging: TapeandReel; Case Code (Metric): 1608; Min Operating Temperature: -55degC; Composition: ThickFilm; RoHSCompliant: true; Contact Plating: Tin; Datasheet Version: Rev. 5, 10/2016; REACH SVHC: NoSVHC
R4 R6 = CMP-1659-00020-2: Chip Resistor, 330 Ohm, +/- 1%, 0.1 W, -55 to 155 degC, 0603 (1608 Metric), RoHS, Tape and Reel; Tolerance: 10%; ESR: 800 mohm; Voltage Rating (DC): 16 V; Capacitance: 47 uF; Length: 7.3 mm; ComponentLink1URL: http://www.yageo.com/; Packaging: Tape and Reel; Pins: 2; ComponentLink1Description: Manufacturer URL; Case Code (Imperial): 2917; REACH SVHC: No SVHC; Width: 4.3 mm; ComponentLink2Description: Datasheet; Voltage Rating: 16 V; RoHSCompliant: True; Max Operating Temperature: 125degC; ComponentLink2URL: http://www.yageo.com/documents/recent/PYu-RC_Group_51_RoHS_L_04.pdf; Min Operating Temperature: -55degC; Case/Package: 2917; Radiation Hardening: No; DatasheetVersion: Rev. 4, 02/2016; Mount: Surface Mount; PackageReference: 0603; Package Quantity: 500; Case Code (Metric): 7343; PackageDescription: 2-Pin Surface Mount Device, Body 1.6 x 0.8 mm; Height: 3.1 mm
R8 = CMP-1747-00002-1: Square Trimpot(R) Trimming Potentiometer, 1000 Ohm, -55 to 125 degC, 3-Pin THD, RoHS, Tube; Case\Package: 0603; Tolerance: 1%; Power Rating: 100 mW; Voltage Rating: 75 V; Resistance: 4.7 kohm; ComponentLink2URL: http://www.bourns.com/docs/Product-Datasheets/3296.pdf; Packaging: Tape and Reel; REACH SVHC: Yes; ComponentLink1URL: http://www.bourns.com/; Case Code (Metric): 1608; Width: 0.8 mm; ComponentLink1Description: Manufacturer URL; DatasheetVersion: May-16; Max Operating Temperature: 155 degC; PackageReference: 3296W-1-3; PackageDescription: 3-Pin Through Hole Device, Body 9.53 x 4.83 mm, Pitch 2.54 mm; Weight: 7.1E-05 oz; ComponentLink2Description: Datasheet; RoHSCompliant: true; Min Operating Temperature: -55 degC; Radiation Hardening: No; Case Code (Imperial): 0603; Length: 1.6 mm; Package Quantity: 5000; Pins: 2; Mount: Surface Mount; Height: 0.45 mm
R9 R10 = CMP-1659-00009-5: as R12 on sheet MCU, Relays & USB; Military Standard: Not; REACH SVHC: No SVHC; Size Code: 0603; Features: Moisture Resistant; Number of Terminations: 2; Technology: THICK FILM; Series: RC; Case Code (Metric): 1608; Resistance Tolerance: 1%; Resistor Type: Thick Film; Termination: SMD/SMT; Contact Plating: Tin; Radiation Hardening: No; Min Operating Temperature: -55°C; Max Operating Temperature: 155°C; Packaging: Tape and Reel; Max Power Dissipation: 100mW; RoHS Compliant: Yes; Height: 0.45mm; Lead Free: Lead Free; Case/Package: 0603; Length: 1.6mm; Tolerance: 1%; Case Code (Imperial): 0603; Construction: Rectangular; Depth: 0.8mm
U1 = CMP-0299-00399-2: 3-V to 5.5-V Multichannel RS-232 Line Driver / Receiver with ±15-kV ESD Protection, 0 to 70 degC, 16-Pin SOIC (D), Green (RoHS & no Sb/Br); Receivers Per Package: 2; ESD HBM(kV): +/-15; ICC(Max)(mA): 1; Supply Voltage(s)(V): 3.3 or 5.0; Single Supply: TRUE; ComponentLink1URL: www.ti.com; ComponentLink3URL: http://www.ti.com/litv/pdf/mpds178g; PackageReference: D0016A; ComponentLink2Description: Datasheet; ComponentLink2URL: http://www.ti.com/general/docs/lit/getliterature.tsp?genericPartNumber=MAX3232&fileType=pdf; ComponentLink1Description: Manufacturer URL; PackageDescription: 16-Pin Plastic Small Outline Integrated Circuit, 9.9 x 3.9 mm, Pitch 1.27 mm Pitch; PackageVersion: revM, Jun-2011; Drivers Per Package: 2; SubFamily: RS-232; DatasheetVersion: SLLS410I; ComponentLink3Description: Package Specification; RS-232: TRUE
U2 = CMP-0316-00103-2: Low-Power RS-485 Transceiver, 0.2 Mbps, 5 V, Half Duplex, -40 to 85 degC, 8-pin MSOP (DGK), Green (RoHS & no Sb/Br); Manufacturer: Texas Instruments; ESD(kV): 15; Supply Voltage(s)(V): 5; # of TX/RX: 1 TX / 1 RX; Receivers Per Package: 1; Fault Protection(V): -9 to 14; Common Mode Range: -7 to 12; ICC(Max)(mA): 0.9; Fail Safe: Idle, Open, Short; Rating: Catalog; Number of Nodes: 256; Signaling Rate(Mbps): 0.2; Footprint: SN75176; PackageDescription: 8-Pin Thin Small Outline Package 3 x 3 mm Body ,0.65 mm Pitch; PartNumber: SN65HVD3082EDGKR; ComponentLink2Description: Package Specification; Code_JEDEC: MO-187-AA; ComponentLink1URL: http://www.ti.com/general/docs/lit/getliterature.tsp?genericPartNumber=SN65HVD3082E&fileType=pdf; Drivers Per Package: 1; Eco-Plan: Green (RoHS & no Sb/Br); PackageReference: DGK0008A; Isolated: No; DatasheetVersion: SLLS562G; SubFamily: RS-485; Duplex: Half; ComponentLink1Description: Datasheet; ComponentLink2URL: http://www.ti.com/litv/pdf/msoi002j; Mounting Technology: Surface Mount; PackageVersion: revE, May-2006

## Nets that join several sheets
+3.3: Power Supply (C18.2 J4.1 U6.4), MCU, Relays & USB (13 pins), Communication & Display (C5.2 U1.16)
+5: Power Supply (C21.2 J6.1 U7.3), Analog Front-End (8 pins), Communication & Display (8 pins)
+12: Power Supply (C24.2 J7.1 U8.3), MCU, Relays & USB (D1.1 D3.1 K1.2 K2.2)
GND: Power Supply (19 pins), Analog Front-End (U4.4 U5.4), MCU, Relays & USB (16 pins), Communication & Display (11 pins)
NetP2_4: MCU, Relays & USB (U3.30), Communication & Display (P2.4)
NetP2_6: MCU, Relays & USB (U3.31), Communication & Display (P2.6)
NetP2_7: MCU, Relays & USB (U3.32), Communication & Display (P2.7)
NetP2_8: MCU, Relays & USB (U3.33), Communication & Display (P2.8)
NetP2_9: MCU, Relays & USB (U3.34), Communication & Display (P2.9)
NetP2_10: MCU, Relays & USB (U3.37), Communication & Display (P2.10)
NetR3_1: MCU, Relays & USB (U3.12), Communication & Display (R3.1 R9.1)
NetR4_2: MCU, Relays & USB (U3.14), Communication & Display (R4.2)
NetR5_1: MCU, Relays & USB (U3.13), Communication & Display (R5.1 R10.1)
NetR6_2: MCU, Relays & USB (U3.15), Communication & Display (R6.2)
NetR16_2: Analog Front-End (R16.2), MCU, Relays & USB (U3.10)
NetR20_2: Analog Front-End (R20.2), MCU, Relays & USB (U3.11)
NetU2_2: MCU, Relays & USB (U3.16), Communication & Display (U2.2 U2.3)